# EAGLE design TeensyCtrlr (EAGLE 7.2.0)

## Sheet 1 of 3: Audio
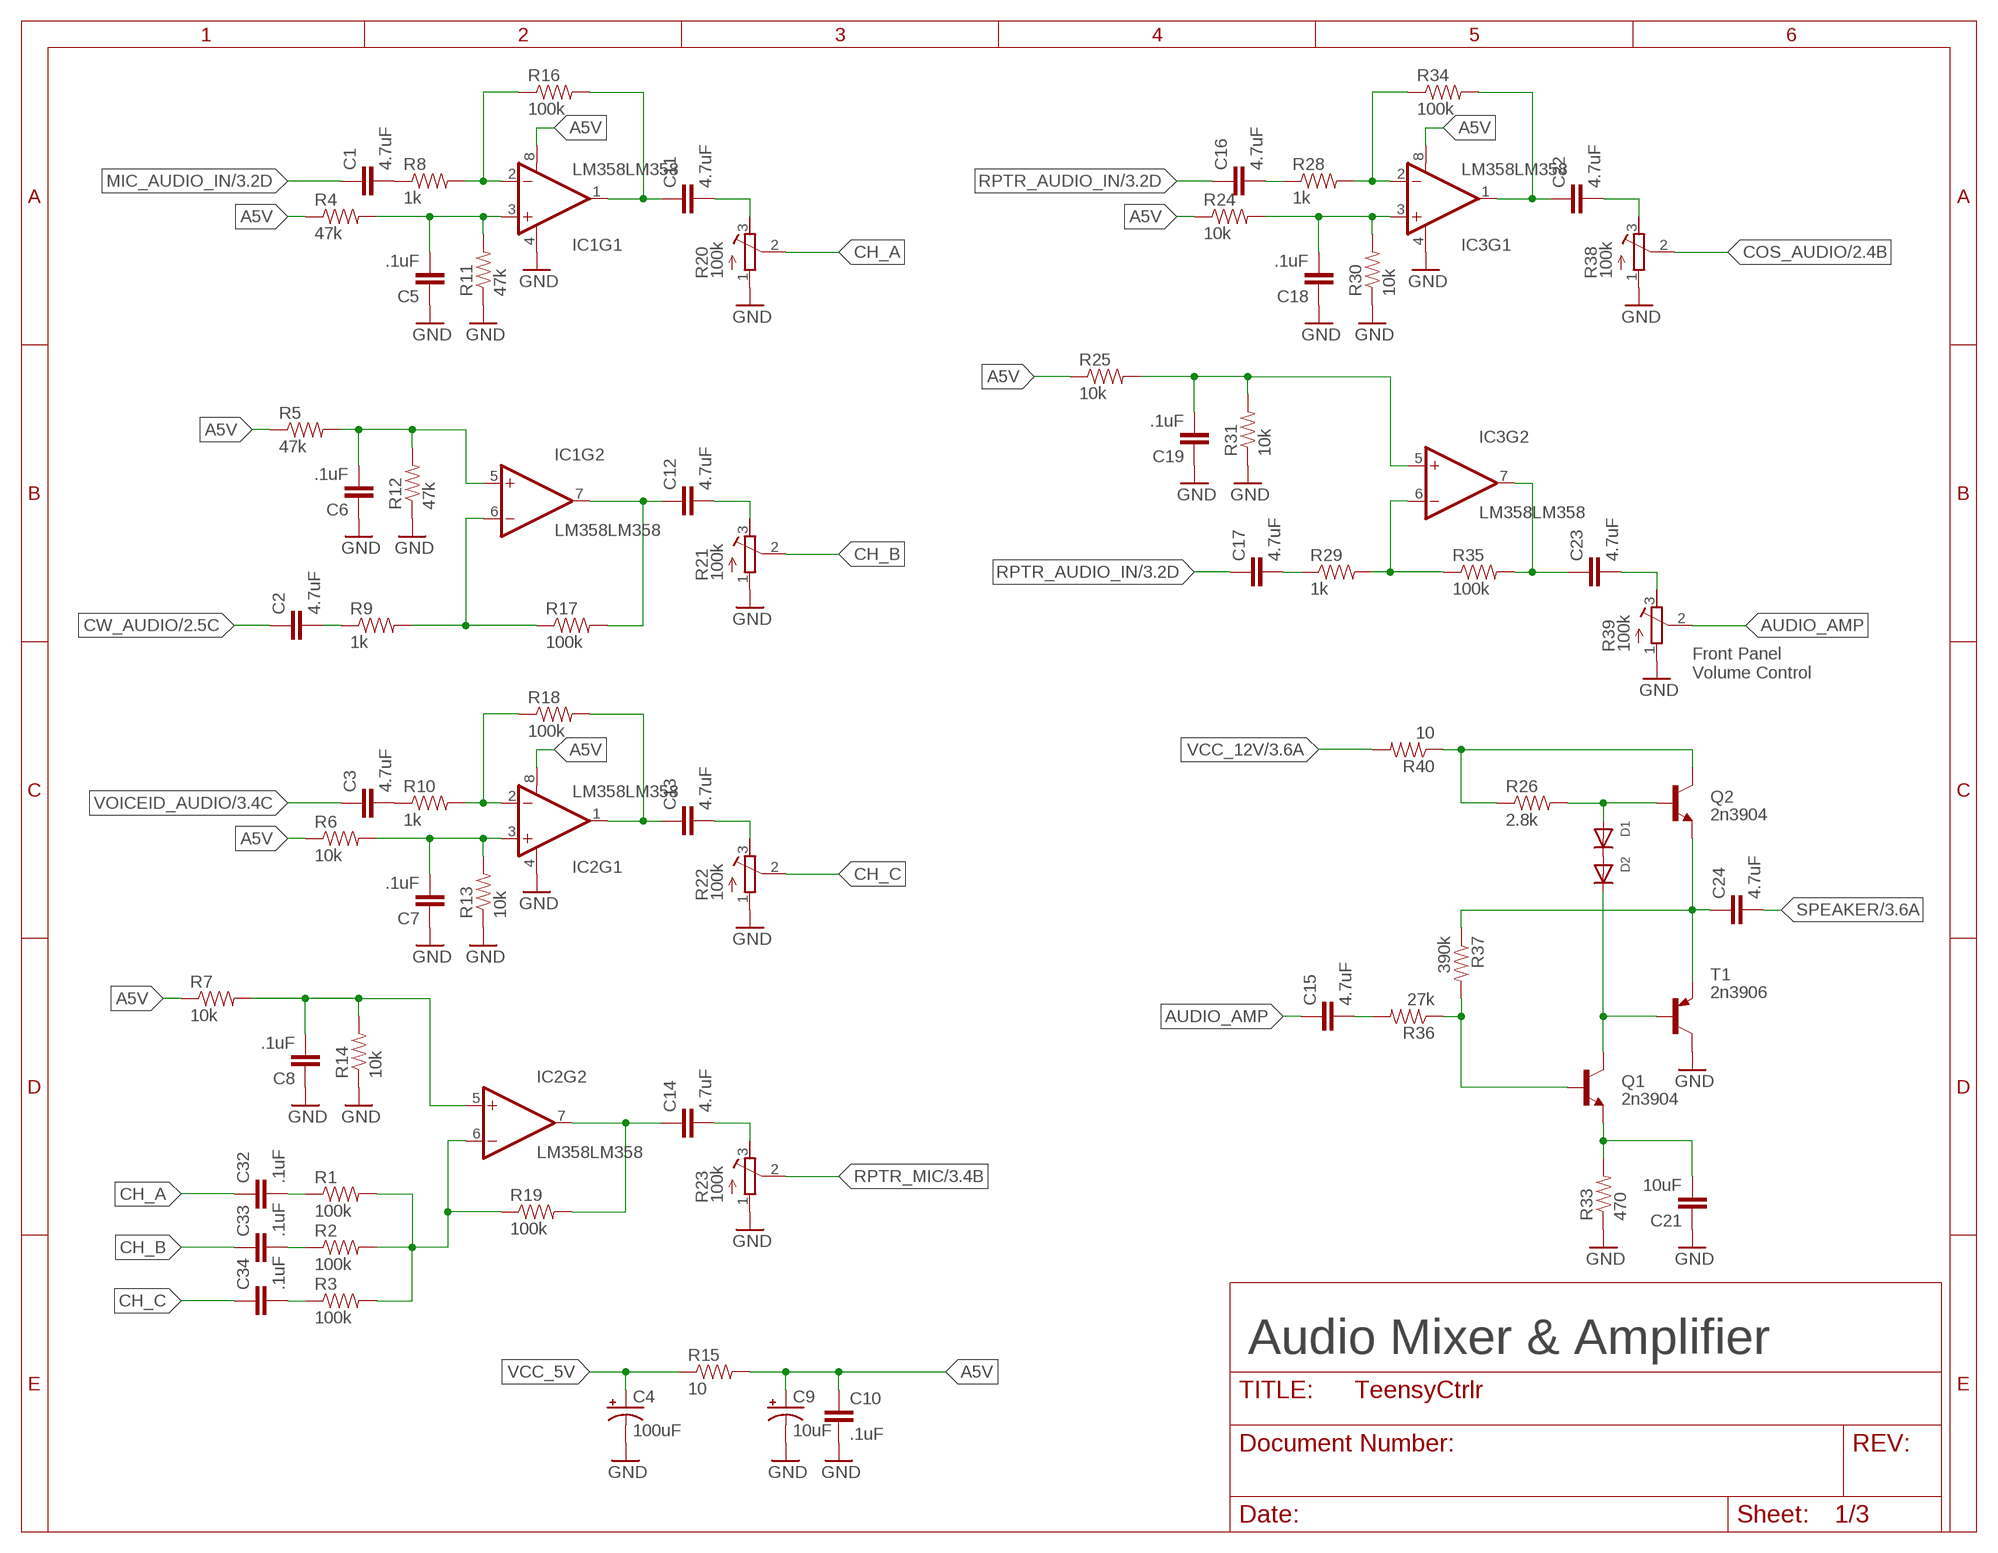
[diagram p0: schematic, sheet 1]

### Parts
C1  4.7uF  CAPPTH2  [CAP-PTH-SMALL2]
C2  4.7uF  CAPPTH2  [CAP-PTH-SMALL2]
C3  4.7uF  CAPPTH2  [CAP-PTH-SMALL2]
C4  100uF  CAP_POLPTH2  [CPOL-RADIAL-10UF-25V]
C5  .1uF  CAP0805  [0805]
C6  .1uF  CAP0805  [0805]
C7  .1uF  CAP0805  [0805]
C8  .1uF  CAP0805  [0805]
C9  10uF  CAP_POLPTH1  [CPOL-RADIAL-100UF-25V]
C10  .1uF  CAP0805  [0805]
C11  4.7uF  CAPPTH2  [CAP-PTH-SMALL2]
C12  4.7uF  CAPPTH2  [CAP-PTH-SMALL2]
C13  4.7uF  CAPPTH2  [CAP-PTH-SMALL2]
C14  4.7uF  CAPPTH2  [CAP-PTH-SMALL2]
C15  4.7uF  CAPPTH  [CAP-PTH-SMALL]
C16  4.7uF  CAPPTH2  [CAP-PTH-SMALL2]
C17  4.7uF  CAPPTH2  [CAP-PTH-SMALL2]
C18  .1uF  CAP0805  [0805]
C19  .1uF  CAP0805  [0805]
C21  10uF  CAPPTH  [CAP-PTH-SMALL]
C22  4.7uF  CAPPTH2  [CAP-PTH-SMALL2]
C23  4.7uF  CAPPTH2  [CAP-PTH-SMALL2]
C24  4.7uF  CAPPTH  [CAP-PTH-SMALL]
C32  .1uF  CAP0805  [0805]
C33  .1uF  CAP0805  [0805]
C34  .1uF  CAP0805  [0805]
D1  DIODEDO-1N4148  [DO-1N4148]
D2  DIODEDO-1N4148  [DO-1N4148]
IC1  LM358LM358  [SOIC8]
IC2  LM358LM358  [SOIC8]
IC3  LM358LM358  [SOIC8]
Q1  2n3904  TRANSISTOR_NPNTO-92-AMMO  [TO-92-AMMO]
Q2  2n3904  TRANSISTOR_NPNTO-92-AMMO  [TO-92-AMMO]
R1  100k  RESISTOR0805-RES  [0805]
R2  100k  RESISTOR0805-RES  [0805]
R3  100k  RESISTOR0805-RES  [0805]
R4  47k  RESISTOR0805-RES  [0805]
R5  47k  RESISTOR0805-RES  [0805]
R6  10k  RESISTOR0805-RES  [0805]
R7  10k  RESISTOR0805-RES  [0805]
R8  1k  RESISTOR0805-RES  [0805]
R9  1k  RESISTOR0805-RES  [0805]
R10  1k  RESISTOR0805-RES  [0805]
R11  47k  RESISTOR0805-RES  [0805]
R12  47k  RESISTOR0805-RES  [0805]
R13  10k  RESISTOR0805-RES  [0805]
R14  10k  RESISTOR0805-RES  [0805]
R15  10  RESISTOR0805-RES  [0805]
R16  100k  RESISTOR0805-RES  [0805]
R17  100k  RESISTOR0805-RES  [0805]
R18  100k  RESISTOR0805-RES  [0805]
R19  100k  RESISTOR0805-RES  [0805]
R20  100k  R-TRIMM3339P  [RTRIM3339P]
R21  100k  R-TRIMM3339P  [RTRIM3339P]
R22  100k  R-TRIMM3339P  [RTRIM3339P]
R23  100k  R-TRIMM3339P  [RTRIM3339P]
R24  10k  RESISTOR0805-RES  [0805]
R25  10k  RESISTOR0805-RES  [0805]
R26  2.8k  RESISTOR0805-RES  [0805]
R28  1k  RESISTOR0805-RES  [0805]
R29  1k  RESISTOR0805-RES  [0805]
R30  10k  RESISTOR0805-RES  [0805]
R31  10k  RESISTOR0805-RES  [0805]
R33  470  RESISTOR0805-RES  [0805]
R34  100k  RESISTOR0805-RES  [0805]
R35  100k  RESISTOR0805-RES  [0805]
R36  27k  RESISTOR0805-RES  [0805]
R37  390k  RESISTOR0805-RES  [0805]
R38  100k  R-TRIMM3339P  [RTRIM3339P]
R39  100k  R-TRIMM3339P  [RTRIM3339P]
R40  10  RESISTOR0805-RES  [0805]
T1  2n3906  BC328-25-PNP-TO92-EBC  [TO92-EBC]

### Nets
A5V: C9.1(+) C10.1 IC1.8(V+) IC2.8(V+) IC3.8(V+) R4.1 R5.1 R6.1 R7.1 R15.2 R24.1 R25.1
AUDIO_AMP: C15.1 R39.2(S)
CH_A: C32.1 R20.2(S)
CH_B: C33.1 R21.2(S)
CH_C: C34.1 R22.2(S)
COS_AUDIO: R38.2(S) ; also sheet 2
CW_AUDIO: C2.1 ; also sheet 2
GND: C4.2(-) C5.1 C6.1 C7.1 C8.1 C9.2(-) C10.2 C18.1 C19.1 C21.1 IC1.4(V-) IC2.4(V-) IC3.4(V-) R11.1 R12.1 R13.1 R14.1 R20.1(A) R21.1(A) R22.1(A) R23.1(A) R30.1 R31.1 R33.1 R38.1(A) R39.1(A) T1.C ; also sheet 2,3
MIC_AUDIO_IN: C1.1 ; also sheet 3
N$1: IC1.2(-IN) R8.2 R16.1
N$2: C5.2 IC1.3(+IN) R4.2 R11.2
N$3: C1.2 R8.1
N$4: C11.2 R20.3(E)
N$5: IC1.6(-IN) R9.2 R17.1
N$6: C11.1 IC1.1(OUT) R16.2
N$7: IC2.2(-IN) R10.2 R18.1
N$8: C6.2 IC1.5(+IN) R5.2 R12.2
N$9: C2.2 R9.1
N$10: C12.1 IC1.7(OUT) R17.2
N$11: C12.2 R21.3(E)
N$12: C7.2 IC2.3(+IN) R6.2 R13.2
N$13: C3.2 R10.1
N$14: C13.1 IC2.1(OUT) R18.2
N$22: C13.2 R22.3(E)
N$23: IC2.6(-IN) R1.2 R2.2 R3.2 R19.1
N$24: C8.2 IC2.5(+IN) R7.2 R14.2
N$25: C15.2 R36.2
N$26: C14.1 IC2.7(OUT) R19.2
N$27: C14.2 R23.3(E)
N$28: Q2.3(C) R26.1 R40.1
N$29: IC3.2(-IN) R28.2 R34.1
N$30: C21.2 Q1.1(E) R33.2
N$31: C18.2 IC3.3(+IN) R24.2 R30.2
N$32: C16.2 R28.1
N$33: C22.1 IC3.1(OUT) R34.2
N$34: C22.2 R38.3(E)
N$35: IC3.6(-IN) R29.2 R35.1
N$36: C19.2 IC3.5(+IN) R25.2 R31.2
N$37: C17.2 R29.1
N$38: C23.1 IC3.7(OUT) R35.2
N$39: C23.2 R39.3(E)
N$40: C24.1 Q2.1(E) R37.1 T1.E
N$41: D1.C D2.A
N$42: D1.A Q2.2(B) R26.2
N$43: D2.C Q1.3(C) T1.B
N$50: C32.2 R1.1
N$51: C33.2 R2.1
N$52: C34.2 R3.1
N$53: Q1.2(B) R36.1 R37.2
RPTR_AUDIO_IN: C16.1 C17.1 ; also sheet 3
RPTR_MIC: R23.2(S) ; also sheet 3
SPEAKER: C24.2 ; also sheet 3
VCC_5V: C4.1(+) R15.1
VCC_12V: R40.2 ; also sheet 3
VOICEID_AUDIO: C3.1 ; also sheet 3

### Notes on the sheet
- Front Panel
  Volume Control
- Audio Mixer & Amplifier

## Sheet 2 of 3: Teensy
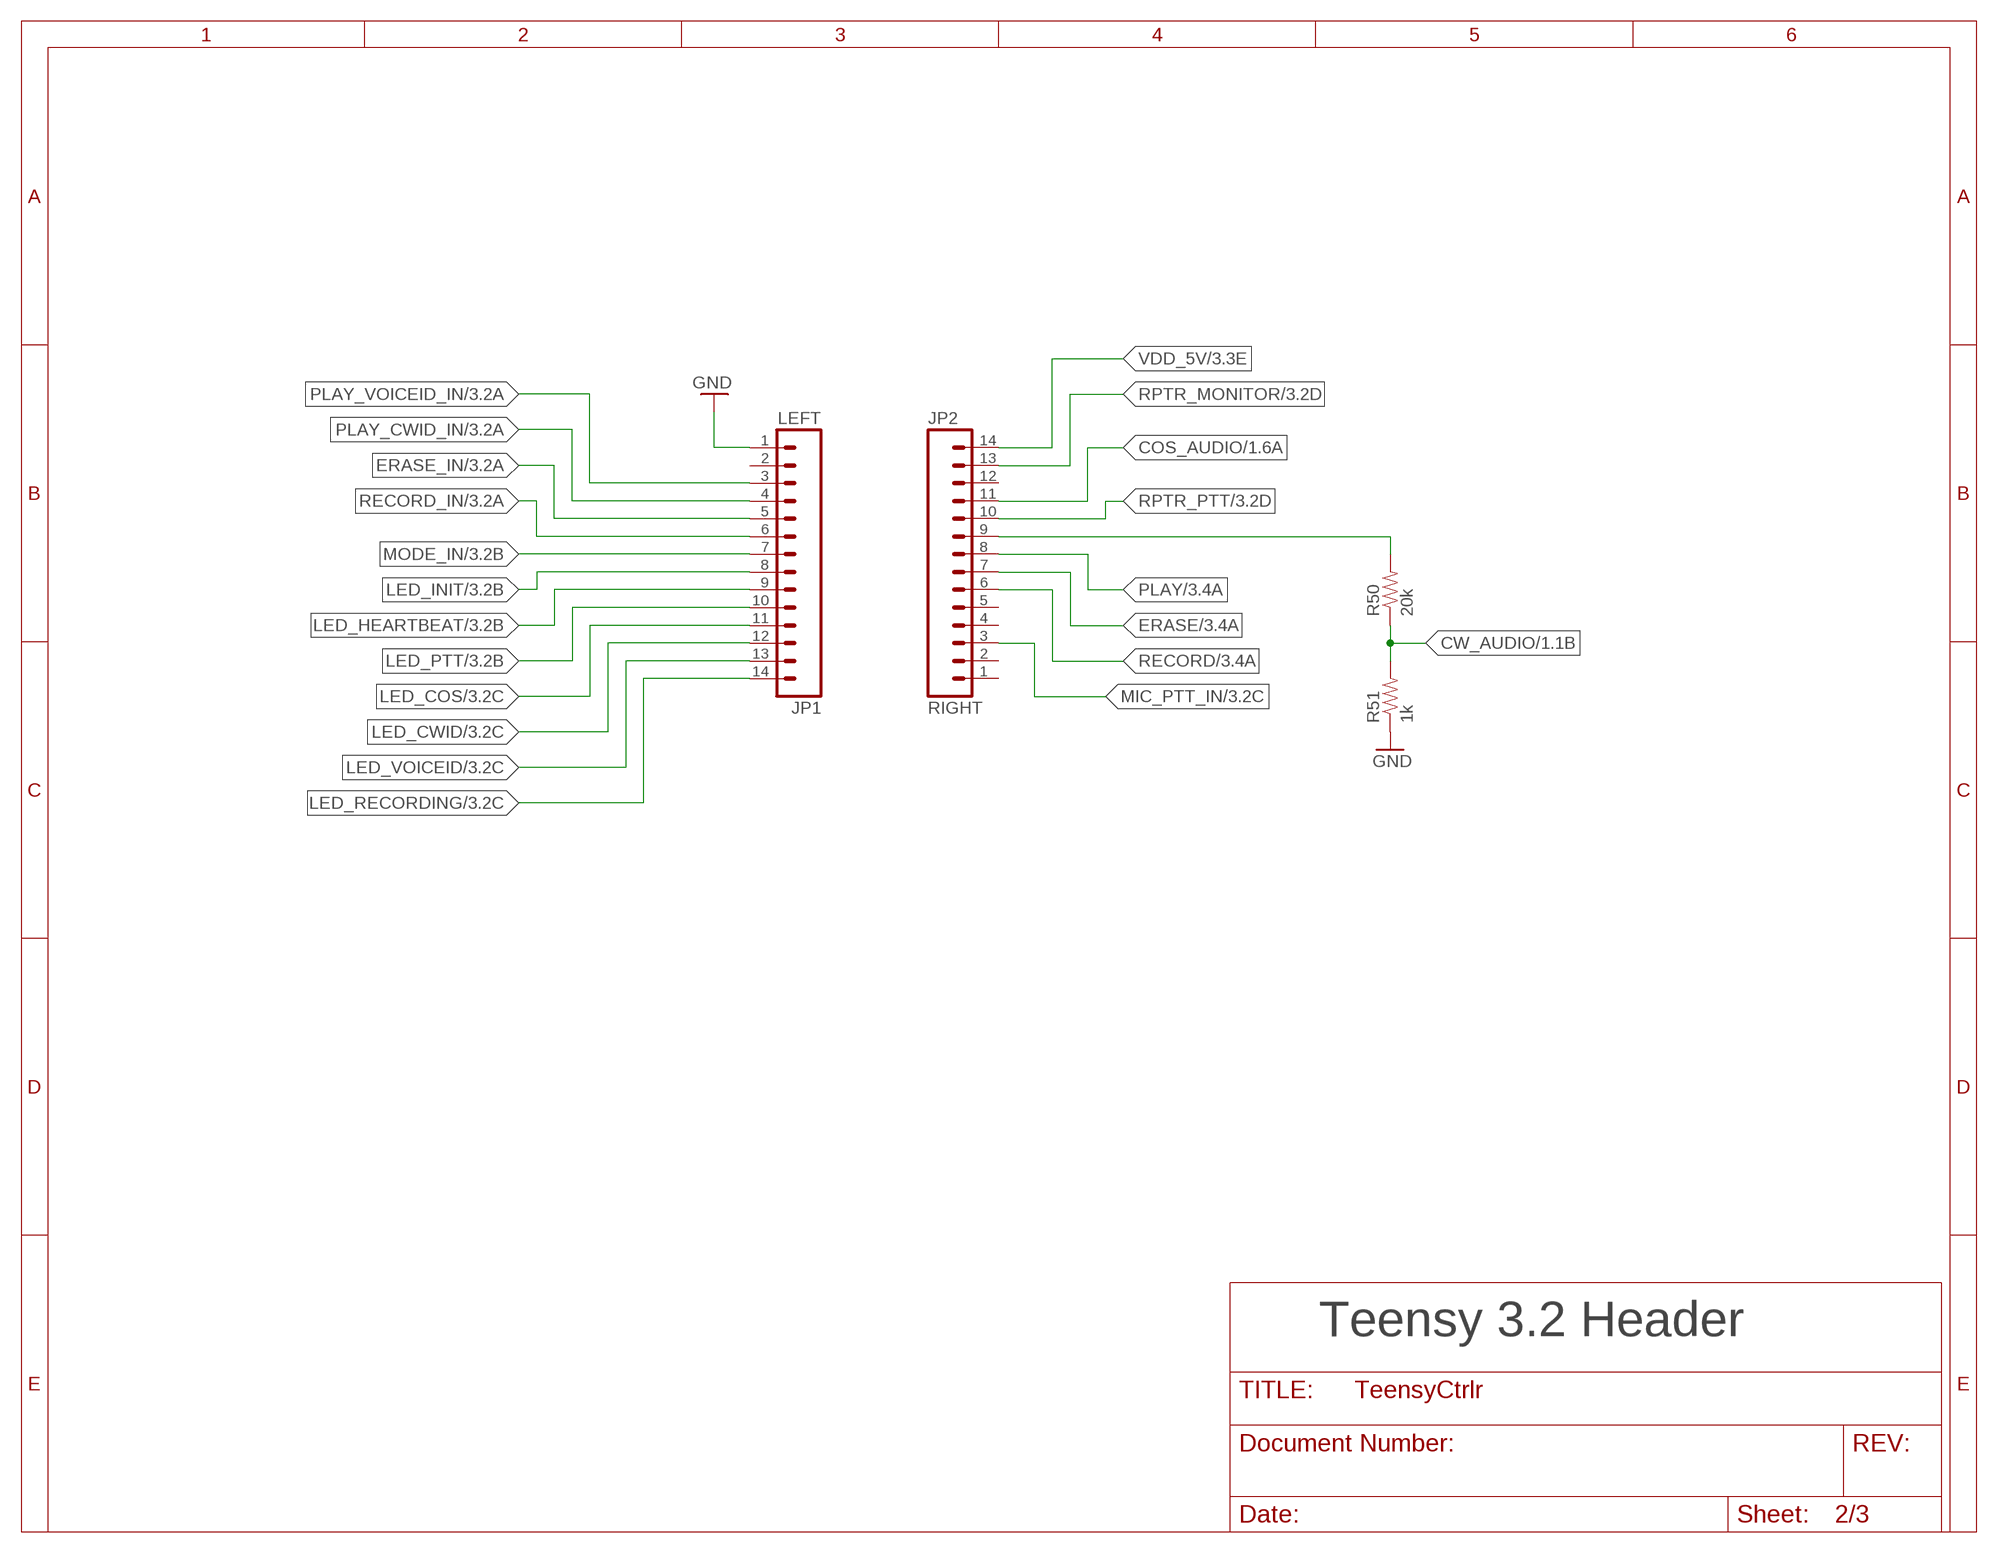
[diagram p1: schematic, sheet 2]

### Parts
JP1  LEFT  M14LONGPADS  [1X14-LONGPADS]
JP2  RIGHT  M14LONGPADS  [1X14-LONGPADS]
R50  20k  RESISTOR0805-RES  [0805]
R51  1k  RESISTOR0805-RES  [0805]

### Nets
COS_AUDIO: JP2.11 ; also sheet 1
CW_AUDIO: R50.1 R51.2 ; also sheet 1
ERASE: JP2.7 ; also sheet 3
ERASE_IN: JP1.5 ; also sheet 3
GND: JP1.1 R51.1 ; also sheet 1,3
LED_COS: JP1.11 ; also sheet 3
LED_CWID: JP1.12 ; also sheet 3
LED_HEARTBEAT: JP1.9 ; also sheet 3
LED_INIT: JP1.8 ; also sheet 3
LED_PTT: JP1.10 ; also sheet 3
LED_RECORDING: JP1.14 ; also sheet 3
LED_VOICEID: JP1.13 ; also sheet 3
MIC_PTT_IN: JP2.3 ; also sheet 3
MODE_IN: JP1.7 ; also sheet 3
N$48: JP2.9 R50.2
PLAY: JP2.8 ; also sheet 3
PLAY_CWID_IN: JP1.4 ; also sheet 3
PLAY_VOICEID_IN: JP1.3 ; also sheet 3
RECORD: JP2.6 ; also sheet 3
RECORD_IN: JP1.6 ; also sheet 3
RPTR_MONITOR: JP2.13 ; also sheet 3
RPTR_PTT: JP2.10 ; also sheet 3
VDD_5V: JP2.14 ; also sheet 3
Unconnected: JP1.2 JP2.1 JP2.2 JP2.4 JP2.5 JP2.12

### Notes on the sheet
- Teensy 3.2 Header

## Sheet 3 of 3: I/O and Power
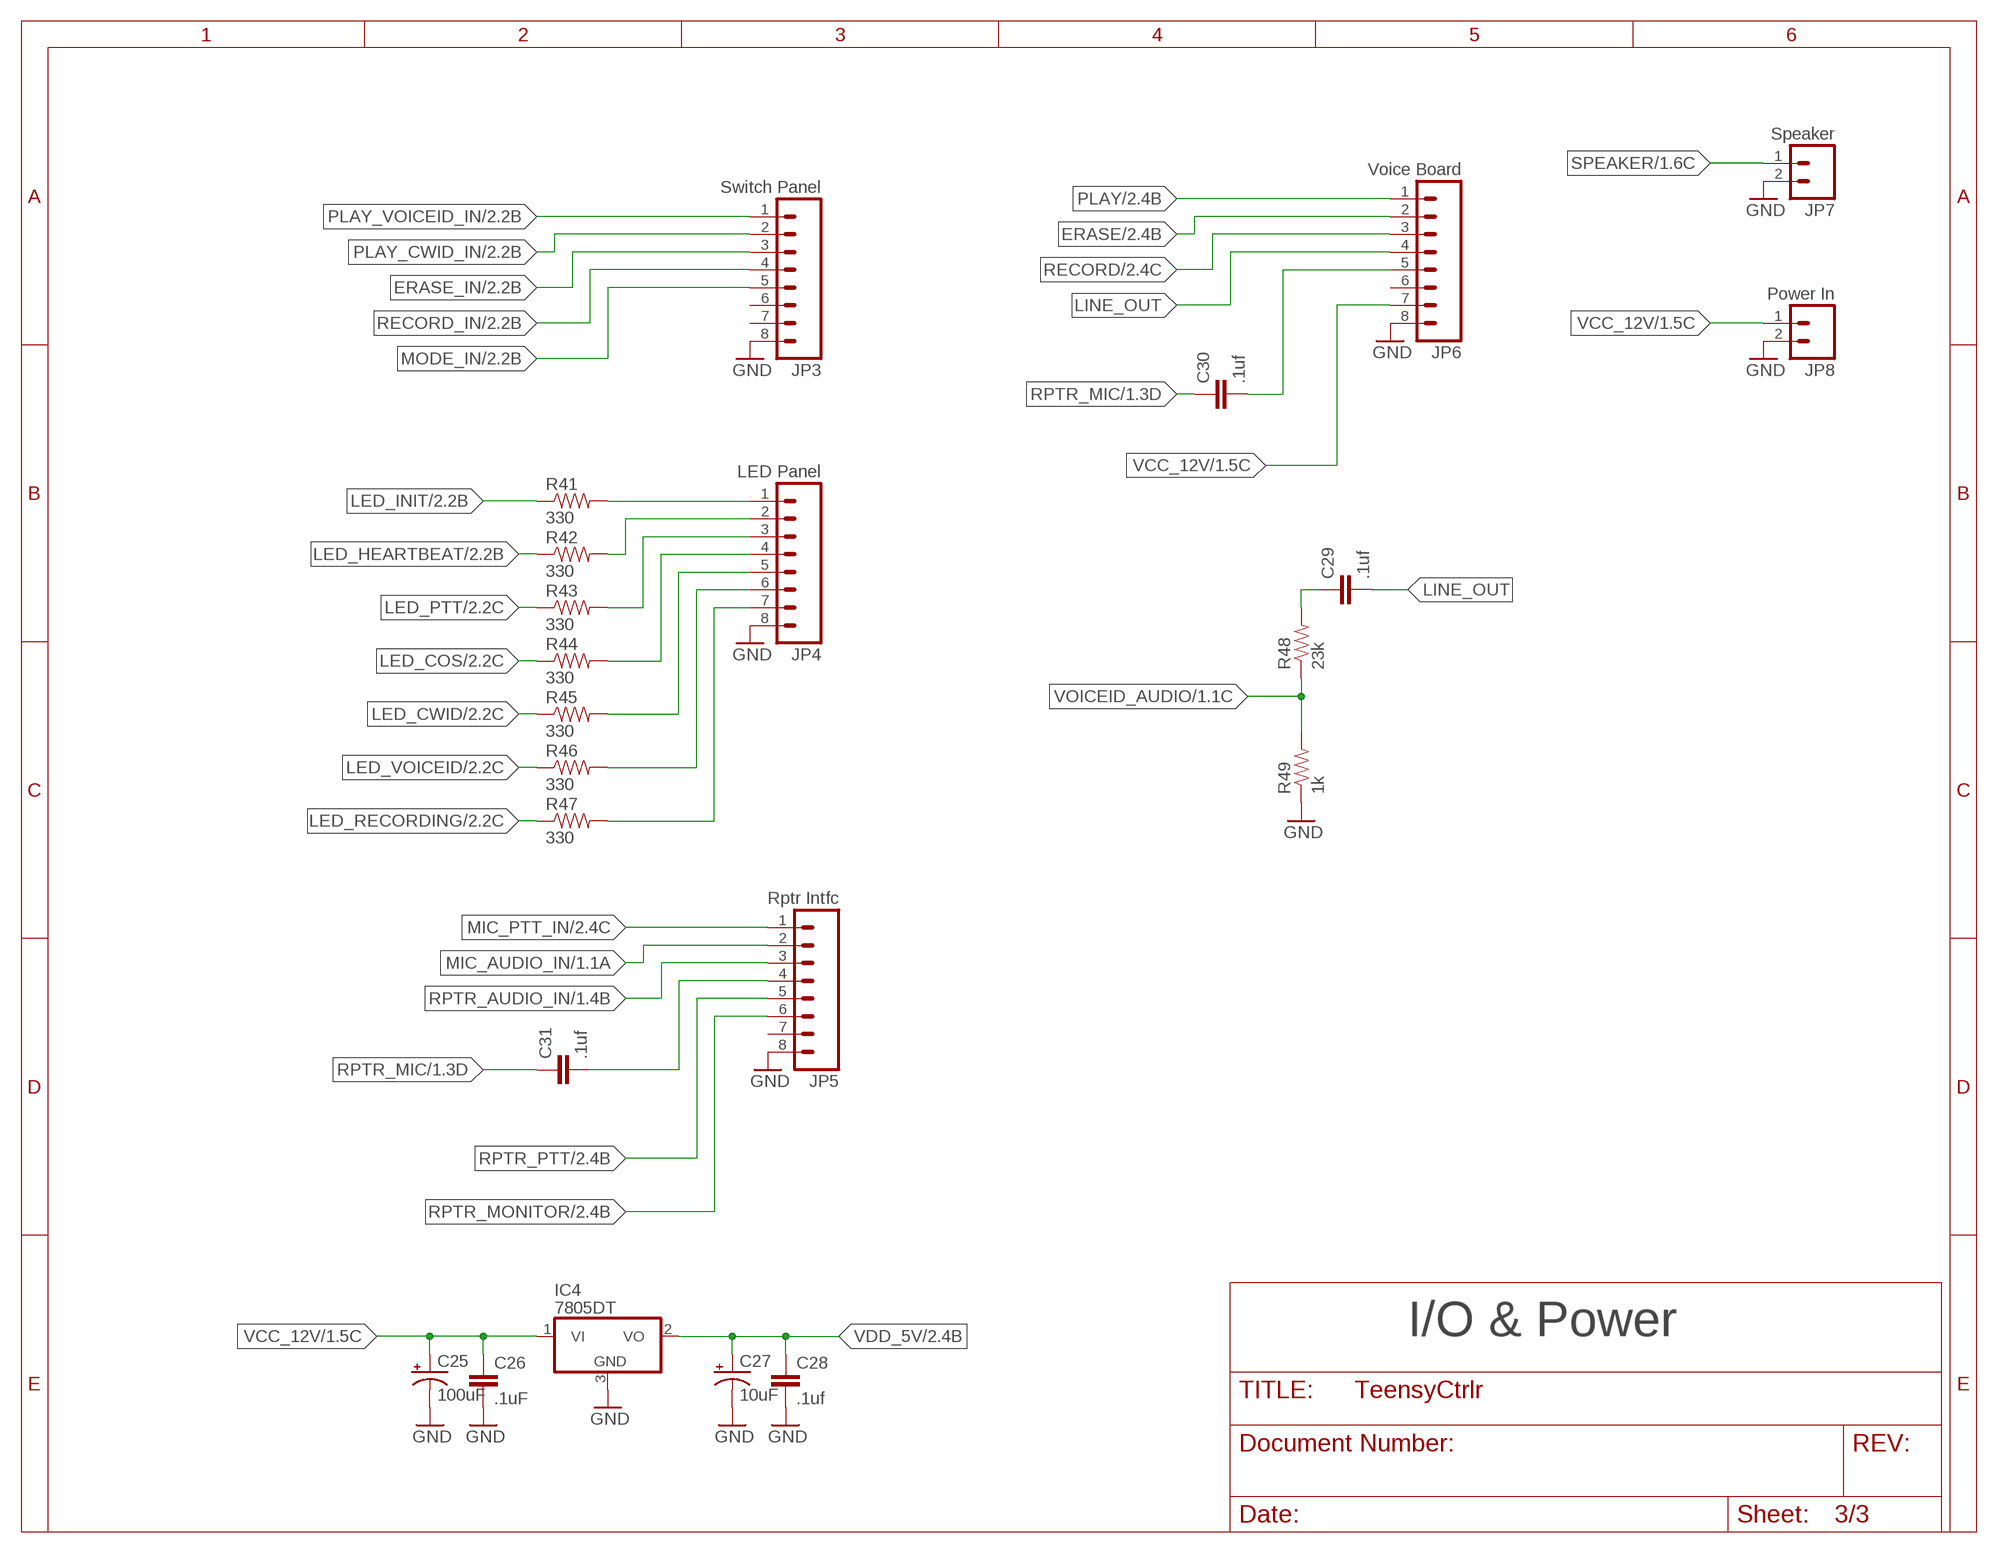
[diagram p2: schematic, sheet 3]

### Parts
C25  100uF  CAP_POLPTH4  [CPOL-RADIAL-1000UF-25V]
C26  .1uF  CAP0805  [0805]
C27  10uF  CAP_POLPTH1  [CPOL-RADIAL-100UF-25V]
C28  .1uf  CAP0805  [0805]
C29  .1uf  CAP0805  [0805]
C30  .1uf  CAP0805  [0805]
C31  .1uf  CAP0805  [0805]
IC4  7805DT  [TO252]
JP3  Switch Panel  M08LONGPADS  [1X08_LONGPADS]
JP4  LED Panel  M08LONGPADS  [1X08_LONGPADS]
JP5  Rptr Intfc  M08LONGPADS  [1X08_LONGPADS]
JP6  Voice Board  M08LONGPADS  [1X08_LONGPADS]
JP7  Speaker  M02PTH3  [1X02_LONGPADS]
JP8  Power In  M02PTH3  [1X02_LONGPADS]
R41  330  RESISTOR0805-RES  [0805]
R42  330  RESISTOR0805-RES  [0805]
R43  330  RESISTOR0805-RES  [0805]
R44  330  RESISTOR0805-RES  [0805]
R45  330  RESISTOR0805-RES  [0805]
R46  330  RESISTOR0805-RES  [0805]
R47  330  RESISTOR0805-RES  [0805]
R48  23k  RESISTOR0805-RES  [0805]
R49  1k  RESISTOR0805-RES  [0805]

### Nets
ERASE: JP6.2 ; also sheet 2
ERASE_IN: JP3.3 ; also sheet 2
GND: C25.- C26.2 C27.2(-) C28.2 IC4.3(GND) JP3.8 JP4.8 JP5.8 JP6.8 JP7.2 JP8.2 R49.1 ; also sheet 1,2
LED_COS: R44.1 ; also sheet 2
LED_CWID: R45.1 ; also sheet 2
LED_HEARTBEAT: R42.1 ; also sheet 2
LED_INIT: R41.1 ; also sheet 2
LED_PTT: R43.1 ; also sheet 2
LED_RECORDING: R47.1 ; also sheet 2
LED_VOICEID: R46.1 ; also sheet 2
LINE_OUT: C29.2 JP6.4
MIC_AUDIO_IN: JP5.2 ; also sheet 1
MIC_PTT_IN: JP5.1 ; also sheet 2
MODE_IN: JP3.5 ; also sheet 2
N$15: JP4.1 R41.2
N$16: JP4.2 R42.2
N$17: JP4.3 R43.2
N$18: JP4.4 R44.2
N$19: JP4.5 R45.2
N$20: JP4.6 R46.2
N$21: JP4.7 R47.2
N$46: C31.2 JP5.4
N$47: C30.2 JP6.5
N$49: C29.1 R48.2
PLAY: JP6.1 ; also sheet 2
PLAY_CWID_IN: JP3.2 ; also sheet 2
PLAY_VOICEID_IN: JP3.1 ; also sheet 2
RECORD: JP6.3 ; also sheet 2
RECORD_IN: JP3.4 ; also sheet 2
RPTR_AUDIO_IN: JP5.3 ; also sheet 1
RPTR_MIC: C30.1 C31.1 ; also sheet 1
RPTR_MONITOR: JP5.6 ; also sheet 2
RPTR_PTT: JP5.5 ; also sheet 2
SPEAKER: JP7.1 ; also sheet 1
VCC_12V: C25.+ C26.1 IC4.1(VI) JP6.7 JP8.1 ; also sheet 1
VDD_5V: C27.1(+) C28.1 IC4.2(VO) ; also sheet 2
VOICEID_AUDIO: R48.1 R49.2 ; also sheet 1
Unconnected: JP3.6 JP3.7 JP5.7 JP6.6

### Notes on the sheet
- I/O & Power

## Library data of the parts
C1-C3 C5-C8 C10-C19 C21-C24 C26 C28-C34 = SparkFun-Capacitors:CAP: Capacitor Standard 0603 ceramic capacitor, and 0.1" leaded capacitor.
C4 C9 C25 C27 = SparkFun-Capacitors:CAP_POL: Capacitor Polarized These are standard SMD and PTH capacitors. Normally 10uF, 47uF, and 100uF in electrolytic and tantalum varieties. Always verify the external diameter of the through hole cap, it varies with capacity, voltage, and manufacturer. The EIA devices should be standard.
D1 D2 = adafruit:DIODE: Diode SMADIODE - SMA Surface Mount Package 20V 1A Schottky Diode Digikey: 641-1014-6-ND DO-1N4148 - Through Hole Small Current Diode SOD-123 20V 1 A (.5mV Vf) Schottky Diode - Digikey: MBRX120TPMSCT-ND SOD-323 10V 570mA (.38mV Vf, 3ns) Schottky Diode - Digikey: ZLLS410CT-ND SOD-523 30V 30mA Schottky Diode (RB751S-40TE61) - Digikey: RB751S-40TE61CT-ND SOT23-R/W - SOT23 Package (R = Solder Paste/Reflow Ovens, W = Hand-Soldering) BAT54Film 40V 300mA - Digikey: 497-7162-1-ND
IC1-IC3 = dt-semis:LM358: Jellybean op-amp
IC4 = linear:78*: Positive VOLTAGE REGULATOR Source: http://cache.national.com/ds/LM/LM78L05.pdf http://www.fairchildsemi.com/ds/LM/LM7805.pdf
JP1 JP2 = SparkFun-Connectors:M14: Header 14 Standard 14-pin 0.1" header. Use with straight break away headers (SKU : PRT-00116), right angle break away headers (PRT-00553), swiss pins (PRT-00743), machine pins (PRT-00117), and female headers (PRT-00115).
JP3-JP6 = SparkFun-Connectors:M08: Header 8 Standard 8-pin 0.1" header. Use with straight break away headers (SKU : PRT-00116), right angle break away headers (PRT-00553), swiss pins (PRT-00743), machine pins (PRT-00117), and female headers (PRT-00115).
JP7 JP8 = SparkFun-Connectors:M02: Standard 2-pin 0.1" header. Use with - straight break away headers ( PRT-00116) - right angle break away headers (PRT-00553) - swiss pins (PRT-00743) - machine pins (PRT-00117) - female headers (PRT-00115) Molex polarized connector foot print use with: PRT-08233 with associated crimp pins and housings. 2.54_SCREWTERM for use with PRT-10571. 3.5mm Screw Terminal footprints for PRT-08084 5mm Screw Terminal footprints for use with PRT-08432
Q1 Q2 = SparkFun-DiscreteSemi:TRANSISTOR_NPN: Generic NPN BJT MMBT2222A - TRANS-08049 (SOT-23, 1A 40V) MPSA42 - TRANS-09116 (SOT-23, 500mA 300V) MMBT5088LT1G - TRANS-11160 (SOT-23, 50 mA 30V) BC547 - COM-08928 <http://www.sparkfun.com/products/8928> (TO-92 45V 100mA) (1.Collector 2.Base 3.Emitter) 2N3904 - COM-00521 <http://www.sparkfun.com/products/521> (TO-92 40V 200mA) (1.Emitter 2.Base 3.Collector) P2N2222A - COM-12852 <http://www.sparkfun.com/products/12852> (TO-92 40V 600mA) (1.Collector 2.Base 3.Emitter)
R1-R19 R24-R26 R28-R31 R33-R37 R40-R51 = SparkFun-Resistors:RESISTOR: Resistor Basic schematic elements and footprints for 0603, 1206, and PTH resistors.
R20-R23 R38 R39 = rcl:R-TRIMM: Trimm resistor
T1 = transistor:*-PNP-: PNP Transistror

## Board
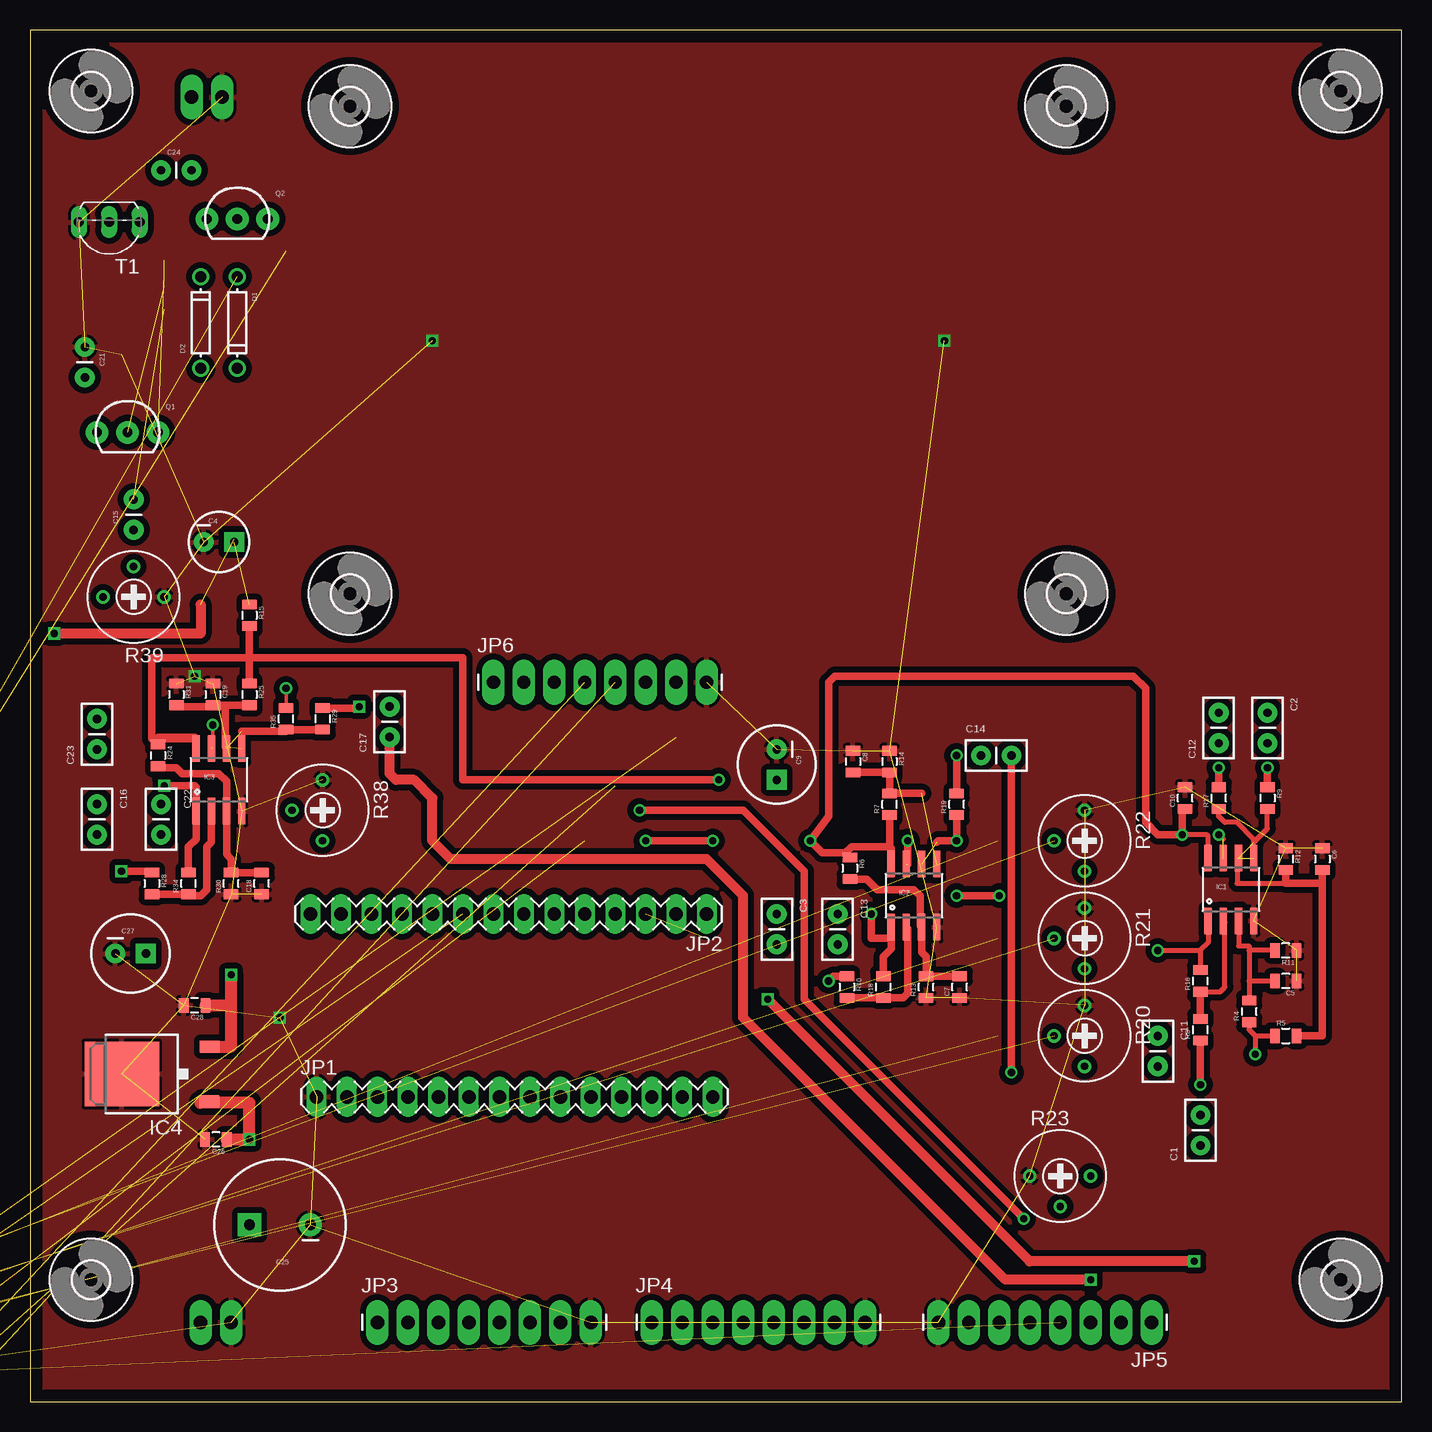
[diagram p3: board, top side]
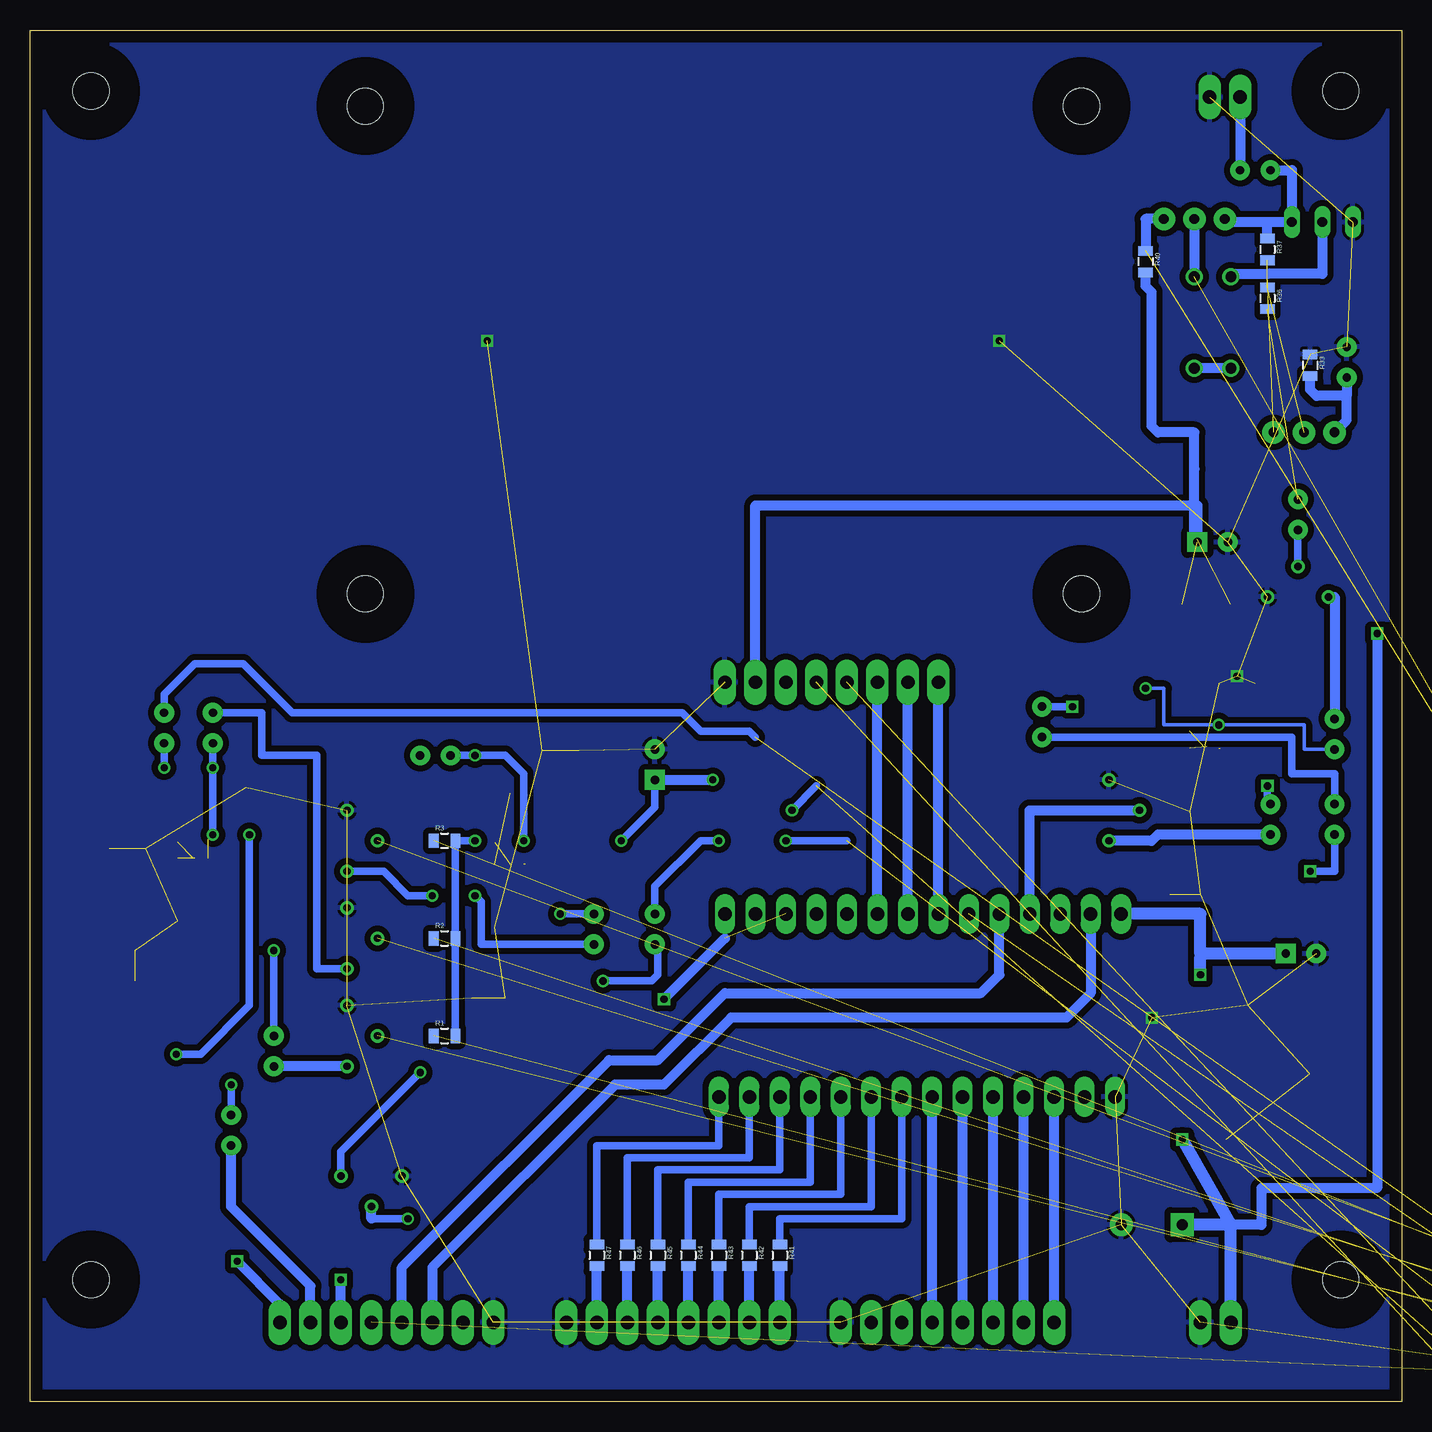
[diagram p4: board, bottom side, seen from below]

Size 114.3 x 114.3 mm. Coordinates in mm from the lower left corner, seen from the top.
Outline: 0,0 114.3,0 114.3,114.3 0,114.3 0,0
Copper layers (1*16): Top 0.035mm / dielectric 1.5mm / Bottom 0.035mm
Design rules "default *": minimum track width 10mil, minimum drill 24mil, track to track 20mil, track to pad 20mil, pad to pad 20mil, via to via 8mil, smd to smd 8mil, copper to edge 40mil, drill to drill 20mil, minimum pad ring 10mil, minimum via ring 8mil, stop-mask expansion 4mil, vias tented up to drill 0mil, thermal gap 10mil
tKeepout: area 21.6,61.7 to 91.4,112.5

### Footprints (pad centres in the part's own frame; a part is rotated, then mirrored left to right if it is on the bottom)
CAP-PTH-SMALL2 = drill 0.7 pad 1.651: 1 0,0; 2 2.54,0
CPOL-RADIAL-10UF-25V = drill 0.7 pad 1.651 square: 1 1.27,0 | drill 0.7 pad 1.651: 2 -1.27,0
0805 = smd 0.8 x 1.2: 1 -0.9,0; 2 0.9,0
CPOL-RADIAL-100UF-25V = drill 0.7 pad 1.651 square: 1 1.27,0 | drill 0.7 pad 1.651: 2 -1.27,0
CAP-PTH-SMALL = drill 0.7 pad 1.651: 1 0,0; 2 2.54,0
CPOL-RADIAL-1000UF-25V = drill 0.9 pad 1.93 square: + 2.54,0 | drill 0.9 pad 1.93: - -2.54,0
DO-1N4148 = drill 0.9: A -3.81,0; C 3.81,0
SOIC8 = smd 0.61 x 2.21: 1 -1.905,-2.616; 2 -0.635,-2.616; 3 0.635,-2.616; 4 1.905,-2.616; 5 1.905,2.616; 6 0.635,2.616; 7 -0.635,2.616; 8 -1.905,2.616
TO252 = smd 1 x 1.6: 1 -2.28,-4.8; 2 2.28,-4.8 | smd 5.4 x 6.2: 3 0,2.5
1X14-LONGPADS = drill 1.118 long: 1 0,0; 2 2.54,0; 3 5.08,0; 4 7.62,0; 5 10.16,0; 6 12.7,0; 7 15.24,0; 8 17.78,0; 9 20.32,0; 10 22.86,0; 11 25.4,0; 12 27.94,0; 13 30.48,0; 14 33.02,0
1X08_LONGPADS = drill 1.118 pad 1.88 long: 1 0,0; 2 2.54,0; 3 5.08,0; 4 7.62,0; 5 10.16,0; 6 12.7,0; 7 15.24,0; 8 17.78,0
1X02_LONGPADS = drill 1.118 pad 1.88 long: 1 0,0; 2 2.54,0
TO-92-AMMO = drill 0.813 pad 1.88: 1 -2.54,0; 2 0,0; 3 2.54,0
RTRIM3339P = drill 0.61: 1 -2.54,0; 2 0,-2.54; 3 2.54,0
TO92-EBC = drill 0.813 long: B 0,-1.27; C 2.54,-1.27; E -2.54,-1.27
3,0 = hole 3: 0,0

### Placement (x,y rotation side)
C1  97.54,21.34 90 top
C2  103.12,57.4 270 top
C3  62.23,40.64 270 top
C4  15.75,71.63 0 top
C5  104.65,35.05 180 top
C6  107.7,45.21 270 top
C7  77.47,34.54 90 top
C8  68.58,53.34 270 top
C9  62.23,53.09 270 top
C10  96.27,50.29 90 top
C11  93.98,30.48 270 top
C12  99.06,54.86 90 top
C13  67.31,40.64 270 top
C14  79.25,53.85 0 top
C15  8.64,72.64 90 top
C16  5.59,49.78 270 top
C17  29.97,55.37 90 top
C18  19.3,43.18 90 top
C19  15.24,58.93 270 top
C21  4.57,87.88 270 top
C22  10.92,49.78 270 top
C23  5.59,54.36 90 top
C24  10.92,102.62 0 top
C25  20.83,14.73 180 top
C26  15.49,21.84 180 top
C27  8.38,37.34 0 top
C28  13.72,33.02 180 top
C29  -8.64,2.03 0 top  (outside the outline)
C30  -5.59,2.03 0 top  (outside the outline)
C31  -17.78,2.03 0 top  (outside the outline)
C32  -26.92,2.03 0 top  (outside the outline)
C33  -29.97,2.03 0 top  (outside the outline)
C34  -33.02,2.03 0 top  (outside the outline)
D1  17.27,89.92 270 top
D2  14.22,89.92 90 top
IC1  100.08,42.67 0 top
IC2  73.66,42.16 0 top
IC3  15.75,51.82 0 top
IC4  10.16,27.3 90 top
JP1  23.88,25.4 0 top
JP2  56.39,40.64 180 top
JP3  28.96,6.6 0 top
JP4  51.82,6.6 0 top
JP5  93.47,6.6 180 top
JP6  38.61,59.94 0 top
JP7  13.46,108.71 0 top
JP8  14.22,6.6 0 top
Q1  8.13,80.77 0 top
Q2  17.27,98.55 0 top
R1  79.76,30.48 0 bottom
R2  79.76,38.61 0 bottom
R3  79.76,46.74 0 bottom
R4  101.6,32.51 90 top
R5  104.65,30.48 0 top
R6  68.33,44.45 270 top
R7  71.63,49.78 90 top
R8  97.54,30.99 90 top
R9  103.12,50.29 270 top
R10  68.07,34.54 270 top
R11  104.65,37.59 180 top
R12  104.65,45.21 270 top
R13  74.68,34.54 90 top
R14  71.63,53.34 270 top
R15  18.29,65.53 270 top
R16  97.54,35.05 90 top
R17  99.06,50.29 90 top
R18  71.12,34.54 90 top
R19  77.22,49.78 90 top
R20  87.88,30.48 270 top
R21  87.88,38.61 270 top
R22  87.88,46.74 270 top
R23  85.85,18.8 0 top
R24  10.67,53.85 270 top
R25  18.29,58.93 270 top
R26  -36.07,2.03 0 top  (outside the outline)
R28  10.16,43.18 270 top
R29  24.38,56.9 270 top
R30  16.76,43.18 90 top
R31  12.19,58.93 270 top
R33  7.62,86.36 270 bottom
R34  13.21,43.18 90 top
R35  21.34,56.9 90 top
R36  11.18,91.95 270 bottom
R37  11.18,96.01 270 bottom
R38  24.38,49.28 270 top
R39  8.64,67.06 180 top
R40  21.34,95 270 bottom
R41  51.82,12.19 270 bottom
R42  54.36,12.19 270 bottom
R43  56.9,12.19 270 bottom
R44  59.44,12.19 270 bottom
R45  61.98,12.19 270 bottom
R46  64.52,12.19 270 bottom
R47  67.06,12.19 270 bottom
R48  -11.68,2.03 0 top  (outside the outline)
R49  -14.73,2.03 0 top  (outside the outline)
R50  -20.83,2.03 0 top  (outside the outline)
R51  -23.88,2.03 0 top  (outside the outline)
T1  6.6,97.03 180 top
U$1  [3,0]  5.08,109.22 0 top
U$2  [3,0]  109.22,109.22 0 top
U$3  [3,0]  109.22,10.16 0 top
U$4  [3,0]  5.08,10.16 0 top
U$5  [3,0]  26.67,107.95 0 top
U$6  [3,0]  86.36,107.95 0 top
U$7  [3,0]  86.36,67.31 0 top
U$8  [3,0]  26.67,67.31 0 top

### Tracks (layer width: path | path; a pad name or v marks a point on that pad's centre or on a via)
A5V  (via drill 0.6)
  Top 0.406: 102.11,30.48 R5.1 | R4.1 101.6,30.99 102.11,30.48 | 102.11,30.48 v102.11,28.96 | IC1.8 98.17,47.12 98.04,47.24 v96.01,47.24
  Top 0.61: IC3.8 13.84,55.24 | 13.84,55.24 13.72,55.37 10.67,55.37 R24.1 | 13.84,55.24 10.16,55.24 10.16,61.98 18.29,61.98 | 18.29,61.98 R15.2 | R25.1 18.29,61.98 | 18.29,61.98 36.07,61.98 36.07,51.82 v57.4,51.82 | 67.96,45.72 66.04,45.72 v65.02,46.74 66.55,48.77 66.55,59.94 67.06,60.45 91.95,60.45 92.96,59.44 92.96,48.26 93.98,47.24 v96.01,47.24 96.01,49.14 C10.1 | 67.96,45.72 R6.1 | IC2.8 71.75,46.1 71.63,46.23 | 71.63,46.23 68.46,46.23 67.96,45.72 | R7.1 71.63,46.23
  Bottom 0.61: C9.1 62.23,49.53 v65.02,46.74 | v102.11,28.96 100.08,28.96 96.01,33.02 v96.01,47.24
  Bottom 0.813: C9.1 v57.4,51.82
AUDIO_AMP
  Bottom 0.61: R39.2 C15.1
CH_A  (1 unrouted)
CH_B  (1 unrouted)
CH_C  (1 unrouted)
COS_AUDIO
  Bottom 0.813: JP2.11 30.99,49.28 R38.2
CW_AUDIO  (2 unrouted)
  Bottom 0.61: 53.85,55.37 54.36,55.88 58.42,55.88 59.94,57.4 92.46,57.4 96.52,61.47 100.58,61.47 103.12,58.93 C2.1
ERASE
  Bottom 0.813: JP2.7 JP6.2
ERASE_IN
  Bottom 0.813: JP3.3 JP1.5
GND  (via drill 0.6)  (44 unrouted)
  other vias: 20.83,32 13.72,60.45 33.53,88.39 76.2,88.39
  pour Bottom: -0.51,0 114.3,0 114.3,114.3 0,114.3
  pour Top: 0,0 114.3,0 114.3,114.3 0,114.3
LED_COS
  Bottom 0.61: JP1.11 49.28,18.29 59.44,18.29 R44.1
LED_CWID
  Bottom 0.61: JP1.12 51.82,19.3 61.98,19.3 R45.1
LED_HEARTBEAT
  Bottom 0.61: JP1.9 44.2,16.26 54.36,16.26 R42.1
LED_INIT
  Bottom 0.61: JP1.8 41.66,15.24 51.82,15.24 R41.1
LED_PTT
  Bottom 0.61: JP1.10 46.74,17.27 56.9,17.27 R43.1
LED_RECORDING
  Bottom 0.61: JP1.14 56.9,21.34 67.06,21.34 R47.1
LED_VOICEID
  Bottom 0.61: JP1.13 54.36,20.32 64.52,20.32 R46.1
LINE_OUT  (1 unrouted)
MIC_AUDIO_IN
  Bottom 0.813: JP5.2 90.93,9.65 97.54,16.26 C1.1
MIC_PTT_IN  (via drill 0.6)  (1 unrouted)
  Top 0.813: v97.03,11.68 83.31,11.68 v61.47,33.53
  Bottom 0.813: JP5.1 93.47,8.13 v97.03,11.68 | v61.47,33.53 56.39,38.61
MODE_IN
  Bottom 0.813: JP3.5 JP1.7
N$1
  Top 0.406: R16.1 99.18,34.15 99.57,34.54 99.57,39.93 IC1.2
  Top 0.61: R8.2 R16.1
N$2
  Top 0.406: IC1.3 100.71,37.97 101.6,37.97 101.6,37.59 | 101.6,35.05 R4.2 | R11.2 101.6,37.59 | 101.6,37.59 101.6,35.05 | 101.6,35.05 C5.2
N$3  (via drill 0.6)
  Top 0.61: v97.54,26.42 R8.1
  Bottom 0.61: C1.2 v97.54,26.42
N$4
  Bottom 0.813: R20.3 C11.2
N$5  (1 unrouted)
  Top 0.406: R9.2 103.12,47.75 101.98,46.61 101.98,46.86 100.58,48.26 99.57,48.26 99.06,48.77 R17.1
N$6  (via drill 0.6)
  Top 0.406: IC1.1 98.17,38.23 97.54,37.59 | 97.54,37.59 R16.2 | v93.98,37.59 97.54,37.59
  Bottom 0.61: C11.1 v93.98,37.59
N$7
  Top 0.61: R10.2 R18.1 72.76,33.64 73.15,34.04 73.15,39.42 IC2.2
N$8  (1 unrouted)
  Top 0.406: 100.58,45.29 100.58,43.18 104.65,43.18
  Top 0.61: R5.2 107.7,30.48 107.7,43.18 | C6.2 107.7,43.18 | 107.7,43.18 104.65,43.18 R12.2
N$9  (via drill 0.6)
  Top 0.61: R9.1 v103.12,52.83
  Bottom 0.61: v103.12,52.83 C2.2
N$10  (via drill 0.6)  (1 unrouted)
  Top 0.406: 99.44,46.86 v99.06,47.24
  Top 0.61: v99.06,52.83 R17.2
  Bottom 0.61: v99.06,47.24 v99.06,52.83 C12.1
N$11
  Bottom 0.61: R21.3 90.42,36.07 90.42,53.85 95,53.85 95,57.4 C12.2
N$12
  Top 0.61: C7.2 R13.2 74.68,37.08 74.3,37.47 IC2.3 74.17,39.67 74.17,42.16 73.66,42.67 70.61,42.67 69.73,43.55 R6.2
N$13  (via drill 0.6)
  Top 0.61: R10.1 66.94,35.44 v66.55,35.05
  Bottom 0.61: v66.55,35.05 62.48,35.05 61.98,35.56 61.98,37.85 C3.2
N$14  (via drill 0.6)
  Top 0.61: IC2.1 71.75,38.61 | 71.75,38.61 71.75,37.72 71.12,37.08 R18.2 | v70.1,40.64 70.1,38.61 71.75,38.61
  Bottom 0.61: C13.1 v70.1,40.64
N$15
  Bottom 0.813: JP4.1 R41.2
N$16
  Bottom 0.813: JP4.2 R42.2
N$17
  Bottom 0.813: JP4.3 R43.2
N$18
  Bottom 0.813: JP4.4 R44.2
N$19
  Bottom 0.813: JP4.5 R45.2
N$20
  Bottom 0.813: JP4.6 R46.2
N$21
  Bottom 0.813: JP4.7 R47.2
N$22  (via drill 0.6)
  Top 0.61: v77.22,42.16 v80.77,42.16
  Bottom 0.61: C13.2 76.71,38.1 76.71,41.66 v77.22,42.16 | v80.77,42.16 82.8,42.16 84.84,44.2 R22.3
N$23  (via drill 0.6)  (1 unrouted)
  Top 0.61: R19.1 v77.22,46.74 75.69,46.74 75.56,46.61
  Bottom 0.61: R1.2 R2.2 R3.2 v77.22,46.74
N$24  (1 unrouted)
  Top 0.61: C8.2 R14.2 R7.2 74.3,50.68
N$25  (1 unrouted)
N$26  (via drill 0.6)  (1 unrouted)
  Top 0.61: 73.15,44.78 v73.15,46.74 | v77.22,53.85 R19.2
  Bottom 0.61: v73.15,46.74 73.15,52.32 74.68,53.85 v77.22,53.85 C14.1
N$27  (via drill 0.6)
  Top 0.61: v81.79,27.43 C14.2
  Bottom 0.61: R23.3 88.39,20.83 v81.79,27.43
N$28  (1 unrouted)
  Bottom 0.813: Q2.3 21.34,98.55 R40.1
N$29
  Top 0.61: R28.2 R34.1 13.32,42.16 14.22,42.16 14.73,42.67 14.73,46.23 15.11,46.61 IC3.2
N$30
  Bottom 0.813: Q1.1 4.57,81.79 4.57,83.82 | C21.2 4.57,83.82 | 4.57,83.82 7.11,83.82 7.62,84.33 R33.2
N$31
  Top 0.61: C18.2 R30.2 16.76,45.21 16.38,45.59 IC3.3 16.38,51.69 15.75,52.32 12.7,52.32 12.19,52.83 10.78,52.83 R24.2
N$32  (via drill 0.6)
  Top 0.61: v7.62,44.2 10.04,44.2 R28.1
  Bottom 0.61: C16.2 5.59,44.2 v7.62,44.2
N$33  (via drill 0.6)
  Top 0.61: R34.2 13.21,46.23 13.84,46.86 IC3.1 13.84,51.18 13.72,51.31 v11.18,51.31
  Bottom 0.61: v11.18,51.31 11.18,50.04 C22.1
N$34
  Bottom 0.813: C22.2 20.32,47.24 20.83,46.74 R38.3
N$35  (1 unrouted)
  Top 0.61: R29.2 R35.1 21.34,55.88 17.65,55.88
N$36  (1 unrouted)
  Top 0.61: R31.2 12.19,57.91 15.12,57.91 | 15.12,57.91 C19.2 R25.2 | 15.12,57.91 16.26,57.91 16.26,54.56
N$37  (via drill 0.6)
  Top 0.61: v27.43,57.91 27.43,57.8 R29.1
  Bottom 0.61: C17.2 v27.43,57.91
N$38  (via drill 0.6)  (1 unrouted)
  Top 0.305: 15.24,54.43 v15.24,56.39 | v21.34,59.44 R35.2
  Bottom 0.305: C23.1 8.13,54.36 8.13,56.39 v15.24,56.39 19.81,56.39 19.81,59.44 v21.34,59.44
N$39
  Bottom 0.813: R39.3 5.59,67.06 C23.2
N$40
  Bottom 0.813: C24.1 9.14,102.62 T1.E 11.18,98.3 | 11.18,98.3 14.73,98.3 Q2.1 | R37.1 11.18,98.3
N$41
  Bottom 0.813: D2.A D1.C
N$42  (1 unrouted)
  Bottom 0.813: Q2.2 D1.A
N$43  (1 unrouted)
  Bottom 0.813: D2.C 14.22,93.98 11.18,93.98 6.6,93.98 T1.B
N$46  (1 unrouted)
N$47  (1 unrouted)
N$48  (1 unrouted)
N$49  (1 unrouted)
N$50  (1 unrouted)
N$51  (1 unrouted)
N$52  (1 unrouted)
N$53  (2 unrouted)
PLAY
  Bottom 0.813: JP2.8 JP6.1
PLAY_CWID_IN
  Bottom 0.813: JP3.2 JP1.4
PLAY_VOICEID_IN
  Bottom 0.813: JP3.1 JP1.3
RECORD
  Bottom 0.813: JP2.6 JP6.3
RECORD_IN
  Bottom 0.813: JP3.4 JP1.6
RPTR_AUDIO_IN  (via drill 0.6)
  Top 0.813: v88.39,10.16 81.28,10.16 59.44,32 59.44,42.16 56.39,45.21 35.05,45.21 33.53,46.74 33.53,50.29 32,51.82 30.48,51.82 29.97,52.32 C17.1
  Bottom 0.61: C16.1 5.59,52.32 9.14,52.32 9.14,55.37 C17.1
  Bottom 0.813: JP5.3 v88.39,10.16
RPTR_MIC  (via drill 0.6)  (2 unrouted)
  Top 0.61: v50.8,49.28 59.44,49.28 64.52,44.2 64.52,33.53 v82.8,15.24
  Bottom 0.61: 48.77,51.31 v50.8,49.28 | v82.8,15.24 85.85,15.24
  Bottom 0.813: 85.85,15.24 R23.2
RPTR_MONITOR
  Bottom 0.813: JP2.13 25.91,34.04 27.94,32 55.88,32 61.47,26.42 65.53,26.42 80.77,11.18 JP5.6
RPTR_PTT
  Bottom 0.813: JP5.5 83.31,11.18 66.04,28.45 61.98,28.45 56.39,34.04 35.05,34.04 33.53,35.56 JP2.10
SPEAKER
  Bottom 0.813: JP7.1 C24.2
VCC_5V  (1 unrouted)
VCC_12V  (via drill 0.6)  (1 unrouted)
  Top 0.813: 14.22,66.43 14.22,64.01 v2.03,64.01
  Top 1.016: C26.1 v18.29,21.84 18.29,24.89 14.22,24.89 IC4.1
  Bottom 0.813: R40.2 21.34,92.96 20.83,92.46 20.83,81.28 20.32,80.77 17.27,80.77 17.27,77.72 17.27,72.14 17.02,71.88 17.02,74.68 53.85,74.68 JP6.7 | v2.03,64.01 2.03,17.78 11.68,17.78 11.68,14.73 17.78,14.73
  Bottom 1.016: JP8.1 14.22,14.73 | 14.22,14.73 17.78,14.73 C25.+ | 14.22,14.73 v18.29,21.84
VDD_5V  (via drill 0.6)
  Top 1.016: IC4.2 16.76,29.59 16.76,33.02 | C28.1 16.76,33.02 | 16.76,33.02 v16.76,35.56
  Bottom 1.016: v16.76,35.56 16.76,37.08 16.76,37.34 | 16.76,37.34 16.76,40.64 JP2.14 | C27.1 16.76,37.34
VOICEID_AUDIO  (via drill 0.6)  (2 unrouted)
  Top 0.61: v51.31,46.74 v56.9,46.74
  Bottom 0.61: 46.23,46.74 v51.31,46.74 | v56.9,46.74 58.42,46.74 62.23,42.93 C3.1